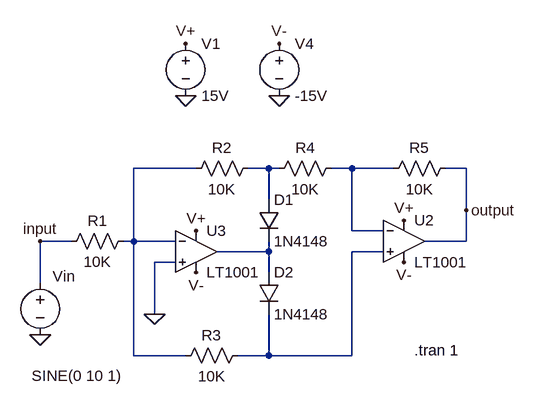
[diagram p0: schematic Full_Wave_rectification.asc]
Full_Wave_rectification.asc, the LTspice schematic file:
Version 4
SHEET 1 2216 948
WIRE 1008 96 912 96
WIRE 1120 96 1088 96
WIRE 1136 96 1120 96
WIRE 1248 96 1216 96
WIRE 1312 96 1248 96
WIRE 1424 96 1392 96
WIRE 1120 144 1120 96
WIRE 1424 160 1424 96
WIRE 1248 192 1248 96
WIRE 1296 192 1248 192
WIRE 816 208 768 208
WIRE 912 208 912 96
WIRE 912 208 896 208
WIRE 976 208 912 208
WIRE 1424 208 1424 160
WIRE 1424 208 1360 208
WIRE 1120 224 1120 208
WIRE 1120 224 1040 224
WIRE 1296 224 1248 224
WIRE 976 240 944 240
WIRE 1120 256 1120 224
WIRE 768 272 768 208
WIRE 944 320 944 240
WIRE 912 384 912 208
WIRE 992 384 912 384
WIRE 1120 384 1120 320
WIRE 1120 384 1072 384
WIRE 1248 384 1248 224
WIRE 1248 384 1120 384
FLAG 992 -16 0
FLAG 992 -96 V+
FLAG 1136 -16 0
FLAG 1136 -96 V-
FLAG 944 320 0
FLAG 768 352 0
FLAG 768 208 input
FLAG 1424 160 output
FLAG 1008 256 V-
FLAG 1328 240 V-
FLAG 1008 192 V+
FLAG 1328 176 V+
SYMBOL voltage 992 -112 R0
WINDOW 123 0 0 Left 2
WINDOW 39 0 0 Left 2
SYMATTR InstName V1
SYMATTR Value 15V
SYMBOL voltage 768 256 R0
WINDOW 123 0 0 Left 2
WINDOW 39 0 0 Left 2
WINDOW 0 19 6 Left 2
WINDOW 3 -13 159 Left 2
SYMATTR InstName Vin
SYMATTR Value SINE(0 10 1)
SYMBOL voltage 1136 -112 R0
WINDOW 123 0 0 Left 2
WINDOW 39 0 0 Left 2
SYMATTR InstName V4
SYMATTR Value -15V
SYMBOL Opamps\\LT1001 1328 144 R0
SYMATTR InstName U2
SYMBOL Opamps\\LT1001 1008 160 R0
SYMATTR InstName U3
SYMBOL res 912 192 R90
WINDOW 0 0 56 VBottom 2
WINDOW 3 32 56 VTop 2
SYMATTR InstName R1
SYMATTR Value 10K
SYMBOL res 1104 80 R90
WINDOW 0 0 56 VBottom 2
WINDOW 3 32 56 VTop 2
SYMATTR InstName R2
SYMATTR Value 10K
SYMBOL res 1088 368 R90
WINDOW 0 0 56 VBottom 2
WINDOW 3 32 56 VTop 2
SYMATTR InstName R3
SYMATTR Value 10K
SYMBOL res 1232 80 R90
WINDOW 0 0 56 VBottom 2
WINDOW 3 32 56 VTop 2
SYMATTR InstName R4
SYMATTR Value 10K
SYMBOL res 1408 80 R90
WINDOW 0 0 56 VBottom 2
WINDOW 3 32 56 VTop 2
SYMATTR InstName R5
SYMATTR Value 10K
SYMBOL diode 1104 144 R0
SYMATTR InstName D1
SYMATTR Value 1N4148
SYMBOL diode 1104 256 R0
SYMATTR InstName D2
SYMATTR Value 1N4148
TEXT 1344 376 Left 2 !.tran 1

The netlist it stands for:
* Full_Wave_rectification.asc
V1 V+ 0 15V
Vin input 0 SINE(0 10 1)
V4 V- 0 -15V
XU2 N005 N003 V+ V- output LT1001  ; pins In+ In- V+ V- OUT
XU3 0 N001 V+ V- N004 LT1001  ; pins In+ In- V+ V- OUT
R1 N001 input 10K
R2 N002 N001 10K
R3 N005 N001 10K
R4 N003 N002 10K
R5 output N003 10K
D1 N002 N004 1N4148
D2 N004 N005 1N4148
.model D D
.lib standard.dio
.tran 1
.lib LTC.lib
.backanno
.end